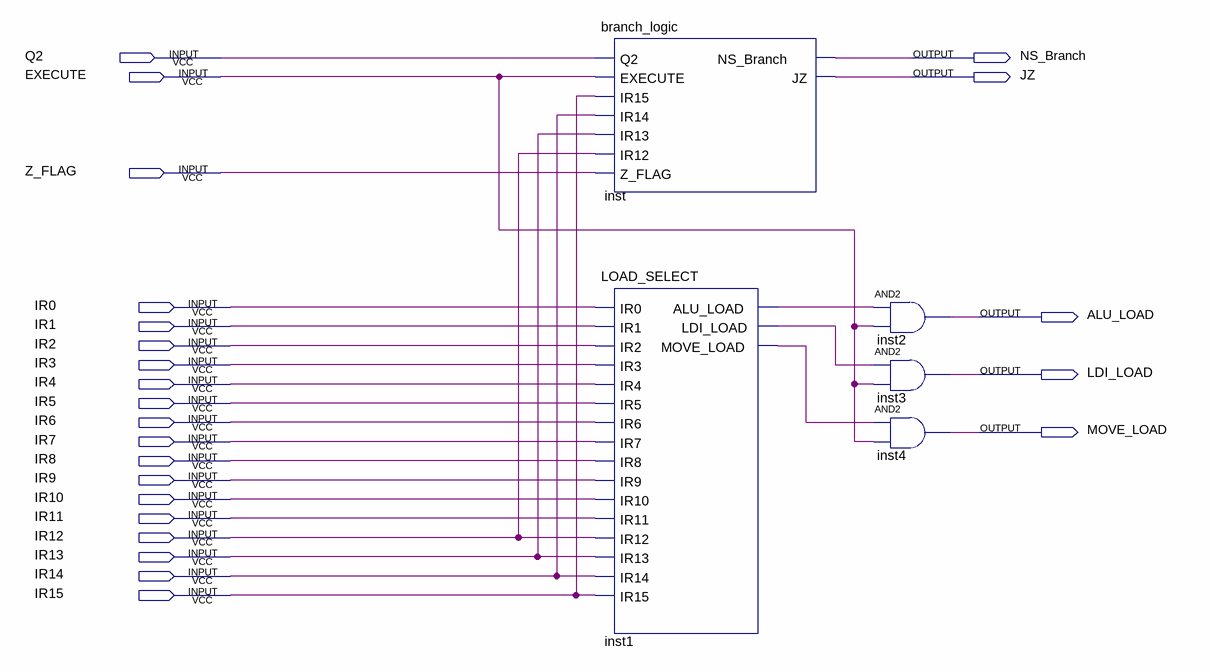
[diagram p0: schematic sheet]
// Quartus schematic Control_Unit.bdf as structural Verilog: 5 symbols, 24 pins
module Control_Unit (
  input  Q2,
  input  EXECUTE,
  input  Z_FLAG,
  input  IR0,
  input  IR1,
  input  IR2,
  input  IR3,
  input  IR4,
  input  IR5,
  input  IR6,
  input  IR7,
  input  IR8,
  input  IR9,
  input  IR10,
  input  IR11,
  input  IR12,
  input  IR13,
  input  IR14,
  input  IR15,
  output NS_Branch,
  output JZ,
  output ALU_LOAD,
  output LDI_LOAD,
  output MOVE_LOAD
);

  wire inst1_alu_load, inst1_ldi_load, inst1_move_load;

  branch_logic inst (
    .Q2(Q2), .EXECUTE(EXECUTE), .IR15(IR15), .IR14(IR14), .IR13(IR13), .IR12(IR12), .Z_FLAG(Z_FLAG),
    .NS_Branch(NS_Branch), .JZ(JZ));
  LOAD_SELECT inst1 (
    .IR0(IR0), .IR1(IR1), .IR2(IR2), .IR3(IR3), .IR4(IR4), .IR5(IR5), .IR6(IR6), .IR7(IR7), .IR8(IR8),
    .IR9(IR9), .IR10(IR10), .IR11(IR11), .IR12(IR12), .IR13(IR13), .IR14(IR14), .IR15(IR15),
    .ALU_LOAD(inst1_alu_load), .LDI_LOAD(inst1_ldi_load), .MOVE_LOAD(inst1_move_load));
  and inst2 (ALU_LOAD, inst1_alu_load, EXECUTE);
  and inst3 (LDI_LOAD, inst1_ldi_load, EXECUTE);
  and inst4 (MOVE_LOAD, inst1_move_load, EXECUTE);
endmodule
